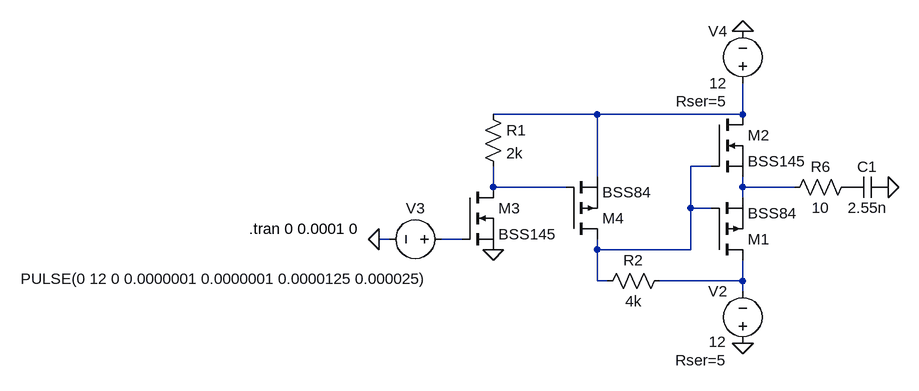
[diagram p0: schematic sender_mosfet.asc]
sender_mosfet.asc, the LTspice schematic file:
Version 4
SHEET 1 1248 692
WIRE 448 224 288 224
WIRE 672 224 672 176
WIRE 672 224 448 224
WIRE 624 304 592 304
WIRE 448 320 448 224
WIRE 288 336 288 304
WIRE 400 336 288 336
WIRE 672 336 672 320
WIRE 752 336 672 336
WIRE 672 352 672 336
WIRE 592 368 592 304
WIRE 624 368 592 368
WIRE 128 416 112 416
WIRE 240 416 208 416
WIRE 448 432 448 416
WIRE 592 432 592 368
WIRE 592 432 448 432
WIRE 448 480 448 432
WIRE 464 480 448 480
WIRE 672 480 672 448
WIRE 672 480 544 480
WIRE 672 496 672 480
FLAG 112 416 0
FLAG 672 576 0
FLAG 672 96 0
FLAG 896 336 0
FLAG 288 432 0
SYMBOL voltage 224 416 R90
WINDOW 0 -32 56 VBottom 2
WINDOW 3 45 346 VTop 2
WINDOW 123 0 0 Left 2
WINDOW 39 0 0 Left 2
SYMATTR InstName V3
SYMATTR Value PULSE(0 12 0 0.0000001 0.0000001 0.0000125 0.000025)
SYMBOL voltage 672 592 R180
WINDOW 0 24 96 Left 2
WINDOW 3 25 18 Left 2
WINDOW 123 0 0 Left 2
WINDOW 39 25 -10 Left 2
SYMATTR InstName V2
SYMATTR Value 12
SYMATTR SpiceLine Rser=5
SYMBOL voltage 672 192 R180
WINDOW 0 24 96 Left 2
WINDOW 3 24 16 Left 2
WINDOW 123 0 0 Left 2
WINDOW 39 24 -12 Left 2
SYMATTR InstName V4
SYMATTR Value 12
SYMATTR SpiceLine Rser=5
SYMBOL cap 896 320 R90
WINDOW 0 0 32 VBottom 2
WINDOW 3 32 32 VTop 2
SYMATTR InstName C1
SYMATTR Value 2.55n
SYMBOL res 848 320 R90
WINDOW 0 0 56 VBottom 2
WINDOW 3 32 56 VTop 2
SYMATTR InstName R6
SYMATTR Value 10
SYMBOL pmos 624 448 M180
SYMATTR InstName M1
SYMATTR Value BSS84
SYMBOL nmos 624 224 R0
SYMATTR InstName M2
SYMATTR Value BSS145
SYMBOL res 272 208 R0
SYMATTR InstName R1
SYMATTR Value 2k
SYMBOL nmos 240 336 R0
SYMATTR InstName M3
SYMATTR Value BSS145
SYMBOL pmos 400 416 M180
SYMATTR InstName M4
SYMATTR Value BSS84
SYMBOL res 560 464 R90
WINDOW 0 0 56 VBottom 2
WINDOW 3 32 56 VTop 2
SYMATTR InstName R2
SYMATTR Value 4k
TEXT -88 400 Left 2 !.tran 0 0.0001 0

The netlist it stands for:
* sender_mosfet.asc
V3 N005 0 PULSE(0 12 0 0.0000001 0.0000001 0.0000125 0.000025)
V2 0 N006 12 Rser=5
V4 N001 0 12 Rser=5
C1 0 P001 2.55n
R6 P001 N004 10
M1 N006 N002 N004 N004 BSS84
M2 N001 N002 N004 N004 BSS145
R1 N001 N003 2k
M3 N003 N005 0 0 BSS145
M4 N002 N003 N001 N001 BSS84
R2 N006 N002 4k
.model NMOS NMOS
.model PMOS PMOS
.lib standard.mos
.tran 0 0.0001 0
.backanno
.end